# EasyEDA Pro project Adorkable_EXP.eprj, board PCB1
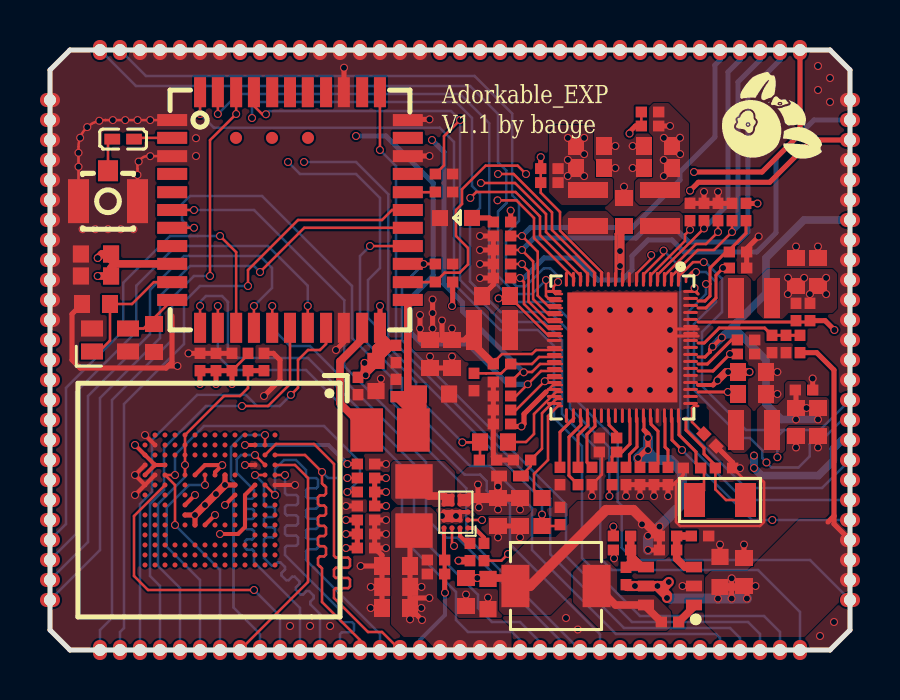
[diagram p3: board, top side]
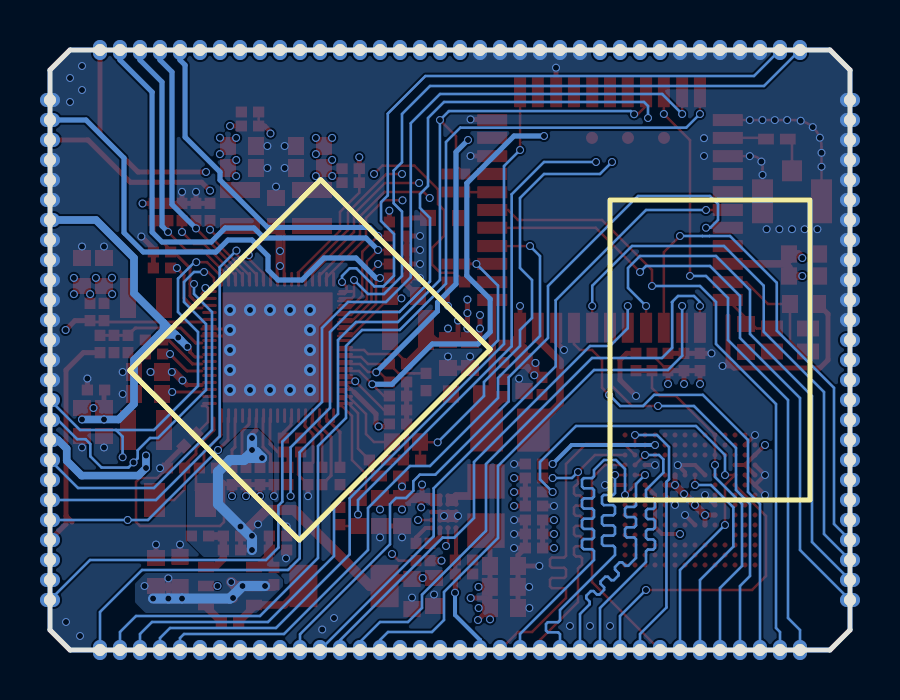
[diagram p4: board, bottom side, seen from below]

Outline 40 x 30 mm; copper layers: Top Layer, GND, PWR, Bottom Layer. Coordinates in mm from the lower left corner of the outline.
Outline path: 0,29 1,30 39,30 40,29 40,1 39,0 1,0 0,1 0,29
Stack: Top Layer 0.035mm 外层铜厚1oz / Dielectric1 0.0994mm 3313 RC57% 4.2mil / GND 0.0152mm 内层铜厚 / Dielectric2 1.265mm 1.3mm H/HOZ Copper / PWR 0.0152mm 内层铜厚 / Dielectric3 0.0994mm 3313 RC57% 4.2mil / Bottom Layer 0.035mm 外层铜厚1oz

## Design rules (mm)
net EMMC_RSTN: EMMC
net EMMC_D0/FLASH_D0: EMMC
net EMMC_CMD: EMMC
net EMMC_D1/FLASH_D1: EMMC
net EMMC_D2/FLASH_D2: EMMC
net EMMC_D3/FLASH_D3: EMMC
net EMMC_D4/FLASH_D4: EMMC
net EMMC_D5/FLASH_D5: EMMC
net EMMC_D6/FLASH_D6: EMMC
net EMMC_D7/FLASH_D7: EMMC
net EMMC_DATA_STROBE: EMMC
net EMMC_CLKOUT/FLASH_DQS: EMMC
template: 自定义配置
spacing copperThickness1oz (default): track to track 0.102, other pairs 0 to 0.3
spacing copperThickness2oz: track to track 0.203, other pairs 0.152 to 0.3
track width copperThickness1oz (default): min 0.127, default 0.127, max 2.54
track width copperThickness2oz: min 0.127, default 0.127, max 2.54
differential pair differentialPair (default): width min 0.127, default 0.254, max 2.54; gap min 0.152, default 0.152
via viaSize (default): diameter min 0.399, default 0.399, max 1.001; hole min 0.3, default 0.3, max 1.001
net GND uses VCC
net VCC5V0_SYS uses VCC
net VDD_LOGIC uses VCC
net VDD_NPU uses VCC
net VDD_GPU uses VCC
net VDD_CPU uses VCC
pour e1499 uses VCC

## Placement (name value [footprint] x y rotation side)
C98  100nF  [R0402]  31 1.4 0 top
C99  10uF  [C0603]  34.7 3.9 270 top
C100  100nF  [R0603]  33.5 3.9 270 top
C101  22pF  [R0402]  30.9 5 180 top
C102  100nF  [R0603]  21.9 2.8 90 top
C103  100nF  [R0402]  28.6 5 0 top
C104  22uF  [C0603]  20.8 2.9 90 top
C105  22uF  [C0603]  28.7 21.9 270 top
C106  10uF  [R0402]  34.4 19.1 0 top
C107  1uF  [R0402]  22.6 19.3 0 top
C108  1uF  [R0402]  22.6 18.6 180 top
C109  1uF  [R0402]  22.6 20 180 top
C110  1uF  [R0402]  22.6 20.7 180 top
C111  1uF  [R0402]  24.97 23.37 0 top
C112  22uF  [C0603]  27 24.1 0 top
C113  10uF  [C0603]  27 25.2 180 top
C114  22uF  [C0603]  37.3 18.9 90 top
C115  10uF  [C0603]  38.4 18.9 270 top
C116  1uF  [R0402]  37.3 16.9 90 top
C117  1uF  [R0402]  22.6 12 0 top
C118  1uF  [R0402]  22.6 13.4 180 top
C119  1uF  [R0402]  22.6 12.7 180 top
C120  1uF  [R0402]  22.6 11.3 180 top
C121  1uF  [R0402]  33.4 21.9 270 top
C122  1uF  [R0402]  34.1 21.9 90 top
C123  10uF  [C0603]  22.3 17.7 0 top
C124  1uF  [R0402]  32.7 21.9 90 top
C125  1uF  [R0402]  32 21.9 90 top
C126  1uF  [R0402]  30 26.2 180 top
C127  22uF  [C0603]  30.4 24.1 180 top
C128  10uF  [C0603]  30.4 25.2 0 top
C129  1uF  [R0402]  34.8 14.8 180 top
C130  1uF  [R0402]  34.8 15.5 0 top
C131  22uF  [C0603]  20.1 14.8 270 top
C132  10uF  [C0603]  19 14.8 90 top
C133  10uF  [C0603]  35.1 13.9 0 top
C134  10uF  [C0603]  35.1 12.8 180 top
C135  22uF  [C0603]  38.4 11.4 270 top
C136  10uF  [C0603]  37.3 11.4 90 top
C137  1uF  [R0402]  30.2 8.7 90 top
C138  1uF  [R0402]  29.5 8.7 270 top
C139  10uF  [R0402]  23.6 9.5 0 top
C140  12pF  [R0402]  32.1 9.1 0 top
C141  4.7uF  [R0402]  26.4 8.7 90 top
C142  100pF  [R0402]  27.9 10.6 180 top
C143  12pF  [R0402]  33.7 9.1 0 top
C144  1uF  [R0402]  27.1 8.7 90 top
C145  1uF  [R0402]  25.5 8.7 90 top
C146  1uF  [R0402]  30.9 8.7 90 top
C147  1uF  [R0402]  28.8 8.7 90 top
C148  680pF  [R0402]  21.9 9.5 180 top
C149  680pF  [R0402]  25.5 6.7 270 top
C150  100nF  [R0402]  28.1 8.7 270 top
C151  100nF  [R0402]  36.1 15.3 90 top
C152  27pF  [R0402]  27.9 9.9 0 top
C153  100nF  [R0402]  34.4 19.9 180 top
C154  100nF  [R0402]  33 10.5 315 top
C155  22uF  [C0603]  22.4 6.9 90 top
C156  22uF  [C0603]  23.5 6.9 90 top
C157  1uF  [R0402]  19.3 4.5 0 top
C158  22uF  [C0603]  17.3 2.1 0 top
C159  22uF  [C0603]  17.31 3.16 0 top
C160  22uF  [C0603]  17.3 4.2 0 top
C162  1uF  [R0402]  37.7 13 180 top
C225  100nF  [R0402]  15.8 7.2 180 top
C226  100nF  [R0402]  9.1 14.4 90 top
C227  100nF  [R0402]  8.3 14.4 90 top
C228  100nF  [R0402]  7.5 14.4 90 top
C229  4.7uF  [R0402]  15.4 13.2 90 top
C230  100nF  [R0402]  15.8 5.1 0 top
C231  100nF  [R0402]  15.8 5.8 0 top
C232  4.7uF  [R0402]  15.8 6.5 180 top
C233  2.2uF  [R0402]  15.8 9.3 180 top
C234  100nF  [R0402]  10.7 14.4 270 top
C261  10pF  [C0402]  3.66 25.55 0 top
C262  100nF  [R0603]  2.3 19.8 0 top
C263  1uF  [R0603]  2.3 18.7 0 top
C264  12pF  [C0603]  5.2 15.6 90 top
C265  12pF  [C0603]  2.3 17.3 0 top
C266  1uF  [R0402]  17.3 14.8 90 top
C267  100nF  [R0603]  16.3 13.7 90 top
C268  4.7uF  [R0402]  17.3 13.1 270 top
C269  100nF  [R0603]  19.2 12.8 180 top
L2  3.3uH  [IND-SMD_L4.4-W4.2]  25.3 3.2 0 top
L3  470nH  [IND-SMD_L2.0-W1.6_MHCHL201610A-1R0M-Q8A]  26.9 22.1 270 top
L4  470nH  [IND-SMD_L2.0-W1.6_MHCHL201610A-1R0M-Q8A]  35.2 17.6 0 top
L5  470nH  [IND-SMD_L2.0-W1.6_MHCHL201610A-1R0M-Q8A]  30.5 22.1 270 top
L6  470nH  [IND-SMD_L2.0-W1.6_MHCHL201610A-1R0M-Q8A]  22.1 16 180 top
L7  470nH  [IND-SMD_L2.0-W1.6_MHCHL201610A-1R0M-Q8A]  35.2 11 0 top
L8  BLM15AG121SN1D  [L0402]  23 8.7 0 top
L9  BLM18PG181SN1D  [L0603]  24.6 6.9 270 top
L10  BLM18PG181SN1D  [L0603]  22.2 10.4 180 top
L11  240nH  [IND-SMD_L2.5-W2.0_WPN252012H]  18.2 7.2 90 top
L16  4.7uH  [L1008]  17 11 180 top
LED1  19-217/GHC-YR1S2/3T  [LED0603-RD]  20.3 21.6 0 top
NOREF  -  [Pad_e213]  19.5 0 0 top
NOREF#2  -  [Pad_e287]  7.5 30 0 top
NOREF#3  -  [Pad_e260]  35.5 30 0 top
NOREF#4  -  [Pad_e195]  37.5 0 0 top
NOREF#5  -  [Pad_e174]  40 16.5 90 top
NOREF#6  -  [Pad_e258]  37.5 30 0 top
NOREF#7  -  [Pad_e223]  9.5 0 0 top
NOREF#8  -  [Pad_e283]  11.5 30 0 top
NOREF#9  -  [Pad_e180]  40 10.5 90 top
NOREF#10  -  [Pad_e281]  13.5 30 0 top
NOREF#11  -  [Pad_e208]  22.5 0 0 top
NOREF#12  -  [Pad_e160]  40 26.5 90 top
NOREF#13  -  [Pad_e267]  26.5 30 0 top
NOREF#14  -  [Pad_e198]  32.5 0 0 top
NOREF#15  -  [Pad_e205]  27.5 0 0 top
NOREF#16  -  [Pad_e252]  0 4.5 90 top
NOREF#17  -  [Pad_e250]  0 6.5 90 top
NOREF#18  -  [Pad_e230]  0 27.5 90 top
NOREF#19  -  [Pad_e241]  0 17.5 90 top
NOREF#20  -  [Pad_e243]  0 15.5 90 top
NOREF#21  -  [Pad_e183]  40 9.5 90 top
NOREF#22  -  [Pad_e280]  12.5 30 0 top
NOREF#23  -  [Pad_e218]  12.5 0 0 top
NOREF#24  -  [Pad_e220]  10.5 0 0 top
NOREF#25  -  [Pad_e278]  17.5 30 0 top
NOREF#26  -  [Pad_e171]  40 21.5 90 top
NOREF#27  -  [Pad_e207]  25.5 0 0 top
NOREF#28  -  [Pad_e269]  24.5 30 0 top
NOREF#29  -  [Pad_e257]  36.5 30 0 top
NOREF#30  -  [Pad_e244]  0 12.5 90 top
NOREF#31  -  [Pad_e273]  20.5 30 0 top
NOREF#32  -  [Pad_e178]  40 12.5 90 top
NOREF#33  -  [Pad_e233]  0 24.5 90 top
NOREF#34  -  [Pad_e206]  24.5 0 0 top
NOREF#35  -  [Pad_e261]  32.5 30 0 top
NOREF#36  -  [Pad_e279]  15.5 30 0 top
NOREF#37  -  [Pad_e232]  0 22.5 90 top
NOREF#38  -  [Pad_e271]  22.5 30 0 top
NOREF#39  -  [Pad_e177]  40 15.5 90 top
NOREF#40  -  [Pad_e165]  40 24.5 90 top
NOREF#41  -  [Pad_e276]  19.5 30 0 top
NOREF#42  -  [Pad_e225]  7.5 0 0 top
NOREF#43  -  [Pad_e222]  8.5 0 0 top
NOREF#44  -  [Pad_e228]  2.5 0 0 top
NOREF#45  -  [Pad_e217]  15.5 0 0 top
NOREF#46  -  [Pad_e291]  3.5 30 0 top
NOREF#47  -  [Pad_e254]  0 2.5 90 top
NOREF#48  -  [Pad_e204]  26.5 0 0 top
NOREF#49  -  [Pad_e182]  40 8.5 90 top
NOREF#50  -  [Pad_e253]  0 5.5 90 top
NOREF#51  -  [Pad_e212]  18.5 0 0 top
NOREF#52  -  [Pad_e240]  0 16.5 90 top
NOREF#53  -  [Pad_e231]  0 26.5 90 top
NOREF#54  -  [Pad_e236]  0 20.5 90 top
NOREF#55  -  [Pad_e189]  40 3.5 90 top
NOREF#56  -  [Pad_e196]  34.5 0 0 top
NOREF#57  -  [Pad_e249]  0 9.5 90 top
NOREF#58  -  [Pad_e265]  28.5 30 0 top
NOREF#59  -  [Pad_e210]  20.5 0 0 top
NOREF#60  -  [Pad_e229]  3.5 0 0 top
NOREF#61  -  [Pad_e221]  11.5 0 0 top
NOREF#62  -  [Pad_e285]  9.5 30 0 top
NOREF#63  -  [Pad_e167]  40 22.5 90 top
NOREF#64  -  [Pad_e288]  4.5 30 0 top
NOREF#65  -  [Pad_e284]  8.5 30 0 top
NOREF#66  -  [Pad_e286]  6.5 30 0 top
NOREF#67  -  [Pad_e203]  29.5 0 0 top
NOREF#68  -  [Pad_e201]  31.5 0 0 top
NOREF#69  -  [Pad_e270]  25.5 30 0 top
NOREF#70  -  [Pad_e251]  0 7.5 90 top
NOREF#71  -  [Pad_e275]  18.5 30 0 top
NOREF#72  -  [Pad_e185]  40 7.5 90 top
NOREF#73  -  [Pad_e282]  10.5 30 0 top
NOREF#74  -  [Pad_e202]  28.5 0 0 top
NOREF#75  -  [Pad_e209]  23.5 0 0 top
NOREF#76  -  [Pad_e199]  33.5 0 0 top
NOREF#77  -  [Pad_e246]  0 10.5 90 top
NOREF#78  -  [Pad_e214]  16.5 0 0 top
NOREF#79  -  [Pad_e247]  0 11.5 90 top
NOREF#80  -  [Pad_e227]  5.5 0 0 top
NOREF#81  -  [Pad_e173]  40 19.5 90 top
NOREF#82  -  [Pad_e262]  33.5 30 0 top
NOREF#83  -  [Pad_e216]  14.5 0 0 top
NOREF#84  -  [Pad_e168]  40 23.5 90 top
NOREF#85  -  [Pad_e186]  40 4.5 90 top
NOREF#86  -  [Pad_e211]  21.5 0 0 top
NOREF#87  -  [Pad_e259]  34.5 30 0 top
NOREF#88  -  [Pad_e184]  40 6.5 90 top
NOREF#89  -  [Pad_e234]  0 25.5 90 top
NOREF#90  -  [Pad_e226]  4.5 0 0 top
NOREF#91  -  [Pad_e170]  40 20.5 90 top
NOREF#92  -  [Pad_e194]  36.5 0 0 top
NOREF#93  -  [Pad_e266]  29.5 30 0 top
NOREF#94  -  [Pad_e264]  31.5 30 0 top
NOREF#95  -  [Pad_e166]  40 25.5 90 top
NOREF#96  -  [Pad_e255]  0 3.5 90 top
NOREF#97  -  [Pad_e239]  0 19.5 90 top
NOREF#98  -  [Pad_e175]  40 17.5 90 top
NOREF#99  -  [Pad_e181]  40 11.5 90 top
NOREF#100  -  [Pad_e268]  27.5 30 0 top
NOREF#101  -  [Pad_e238]  0 18.5 90 top
NOREF#102  -  [Pad_e256]  14.5 30 0 top
NOREF#103  -  [Pad_e272]  23.5 30 0 top
NOREF#104  -  [Pad_e263]  30.5 30 0 top
NOREF#105  -  [Pad_e187]  40 5.5 90 top
NOREF#106  -  [Pad_e274]  21.5 30 0 top
NOREF#107  -  [Pad_e242]  0 14.5 90 top
NOREF#108  -  [Pad_e235]  0 23.5 90 top
NOREF#109  -  [Pad_e245]  0 13.5 90 top
NOREF#110  -  [Pad_e188]  40 2.5 90 top
NOREF#111  -  [Pad_e237]  0 21.5 90 top
NOREF#112  -  [Pad_e172]  40 18.5 90 top
NOREF#113  -  [Pad_e179]  40 13.5 90 top
NOREF#114  -  [Pad_e197]  35.5 0 0 top
NOREF#115  -  [Pad_e290]  2.5 30 0 top
NOREF#116  -  [Pad_e277]  16.5 30 0 top
NOREF#117  -  [Pad_e176]  40 14.5 90 top
NOREF#118  -  [Pad_e224]  6.5 0 0 top
NOREF#119  -  [Pad_e289]  5.5 30 0 top
NOREF#120  -  [Pad_e200]  30.5 0 0 top
NOREF#121  -  [Pad_e248]  0 8.5 90 top
NOREF#122  -  [Pad_e219]  13.5 0 0 top
NOREF#123  -  [Pad_e215]  17.5 0 0 top
NOREF#124  -  [Pad_e158]  40 27.5 90 top
R36  47kΩ  [R0402]  28.8 3.7 270 top
R37  232kΩ  [R0402]  30.9 5.7 180 top
R39  4.7kΩ  [R0402]  22.6 21.4 0 top
R40  51kΩ  [R0402]  32.5 5.7 180 top
R41  0402WGF1000TCE  [R0402]  24.97 24.07 0 top
R42  0402WGF1000TCE  [R0402]  38 16.9 90 top
R43  0402WGF1000TCE  [R0402]  30 26.9 180 top
R44  47kΩ  [R0402]  22.6 14.3 0 top
R45  120kΩ  [R0402]  21.2 13.4 90 top
R48  180kΩ  [R0402]  37.5 15.3 270 top
R49  10kΩ  [R0402]  19.7 18.4 180 top
R51  56kΩ  [R0402]  36.8 15.3 90 top
R52  10kΩ  [R0402]  34.8 21.9 270 top
R53  0402WGF5102TCE  [R0402]  21 4.9 270 top
R54  0402WGF1000TCE  [R0402]  19.3 3.8 0 top
R57  22Ω  [R0402]  21.7 4.9 90 top
R84  10kΩ  [R0402]  15.8 8.6 180 top
R85  10kΩ  [R0402]  15.8 7.9 0 top
R86  10kΩ  [R0402]  9.9 14.4 90 top
R106  10kΩ  [R0402]  19.7 23.8 180 top
R107  0Ω  [R0402]  19.7 22.9 0 top
R108  4.7kΩ  [R0402]  19.7 19.3 0 top
R122  30kΩ  [R0402]  28.6 5.7 0 top
RF1  BWIPX-1-001E  [IPEX-SMD_BWIPX-1-001E]  2.9 23.2 270 top
U2  SY8113BADC  [TSOT-23-6_L2.9-W1.6-P0.95-LS2.8-BR]  31 3.2 0 top
U3  -  [TCS4525]  20.9 6.1 180 top
U6  SDINBDG4-8G  [FBGA-153_L13.0-W11.5-P0.50_KLMAG1JETD-B041]  8 7.5 270 top
U15  2.4GHz  [QFN-44_L12.0-W12.0-P0.90-TL_AP6212]  12 22 0 top
U21  -  [RK809-5]  29 15 270 top
X2  32.768kHz  [CRYSTAL-SMD_L3.2-W1.5-1]  33.5 7.5 180 top
X3  26MHz  [CRYSTAL-SMD_4P-L2.0-W1.6-BL]  3 15.5 0 top

## Footprints (pads in the part's own frame, mm; a bottom-side part is the same pattern mirrored in y, then rotated)
C0402
  rect 0.79x0.54 smd: 1(-0.545,0) 2(0.545,0)
C0603
  rect 0.8x0.9 smd: 1(-0.7,0) 2(0.7,0)
CRYSTAL-SMD_4P-L2.0-W1.6-BL
  rect 1.1x0.8 smd: 1(-0.9,-0.575) 2(0.9,-0.575) 3(0.9,0.575) 4(-0.9,0.575)
CRYSTAL-SMD_L3.2-W1.5-1
  rect 1.05x1.7 smd: 1(-1.275,0) 2(1.275,0)
FBGA-153_L13.0-W11.5-P0.50_KLMAG1JETD-B041
  round 0.25 smd: A1(-3.25,3.25) A3(-2.25,3.25) A4(-1.75,3.25) A5(-1.25,3.25) A6(-0.75,3.25) A8(0.25,3.25) A9(0.75,3.25) A10(1.25,3.25) A11(1.75,3.25) A12(2.25,3.25) A13(2.75,3.25) A14(3.25,3.25) B2(-2.75,2.75) B3(-2.25,2.75) B4(-1.75,2.75) B5(-1.25,2.75) B6(-0.75,2.75) B7(-0.25,2.75) B8(0.25,2.75) B9(0.75,2.75) B10(1.25,2.75) B11(1.75,2.75) B12(2.25,2.75) B13(2.75,2.75) B14(3.25,2.75) C1(-3.25,2.25) C2(-2.75,2.25) C4(-1.75,2.25) C6(-0.75,2.25) C7(-0.25,2.25) C8(0.25,2.25) C9(0.75,2.25) C10(1.25,2.25) C11(1.75,2.25) C12(2.25,2.25) C13(2.75,2.25) C14(3.25,2.25) D1(-3.25,1.75) D3(-2.25,1.75) D4(-1.75,1.75) D12(2.25,1.75) D13(2.75,1.75) D14(3.25,1.75) E1(-3.25,1.25) E2(-2.75,1.25) E3(-2.25,1.25) E5(-1.25,1.25) E6(-0.75,1.25) E7(-0.25,1.25) E8(0.25,1.25) E9(0.75,1.25) E10(1.25,1.25) E12(2.25,1.25) E13(2.75,1.25) E14(3.25,1.25) F1(-3.25,0.75) F2(-2.75,0.75) F3(-2.25,0.75) F5(-1.25,0.75) F10(1.25,0.75) F12(2.25,0.75) F13(2.75,0.75) F14(3.25,0.75) G1(-3.25,0.25) G2(-2.75,0.25) G3(-2.25,0.25) G5(-1.25,0.25) G10(1.25,0.25) G12(2.25,0.25) G13(2.75,0.25) G14(3.25,0.25) H1(-3.25,-0.25) H2(-2.75,-0.25) H3(-2.25,-0.25) H5(-1.25,-0.25) H10(1.25,-0.25) H12(2.25,-0.25) H13(2.75,-0.25) H14(3.25,-0.25) J1(-3.25,-0.75) J2(-2.75,-0.75) J3(-2.25,-0.75) J5(-1.25,-0.75) J10(1.25,-0.75) J12(2.25,-0.75) J13(2.75,-0.75) J14(3.25,-0.75) K1(-3.25,-1.25) K2(-2.75,-1.25) K3(-2.25,-1.25) K5(-1.25,-1.25) K6(-0.75,-1.25) K7(-0.25,-1.25) K8(0.25,-1.25) K9(0.75,-1.25) K10(1.25,-1.25) K12(2.25,-1.25) K13(2.75,-1.25) K14(3.25,-1.25) L1(-3.25,-1.75) L2(-2.75,-1.75) L3(-2.25,-1.75) L12(2.25,-1.75) L13(2.75,-1.75) L14(3.25,-1.75) M1(-3.25,-2.25) M2(-2.75,-2.25) M3(-2.25,-2.25) M4(-1.75,-2.25) M5(-1.25,-2.25) M6(-0.75,-2.25) M7(-0.25,-2.25) M8(0.25,-2.25) M9(0.75,-2.25) M10(1.25,-2.25) M11(1.75,-2.25) M12(2.25,-2.25) M13(2.75,-2.25) M14(3.25,-2.25) N1(-3.25,-2.75) N2(-2.75,-2.75) N3(-2.25,-2.75) N4(-1.75,-2.75) N5(-1.25,-2.75) N6(-0.75,-2.75) N8(0.25,-2.75) N9(0.75,-2.75) N10(1.25,-2.75) N11(1.75,-2.75) N12(2.25,-2.75) N13(2.75,-2.75) N14(3.25,-2.75) P1(-3.25,-3.25) P2(-2.75,-3.25) P3(-2.25,-3.25) P4(-1.75,-3.25) P5(-1.25,-3.25) P6(-0.75,-3.25) P7(-0.25,-3.25) P9(0.75,-3.25) P10(1.25,-3.25) P11(1.75,-3.25) P12(2.25,-3.25) P13(2.75,-3.25) P14(3.25,-3.25)
IND-SMD_L2.0-W1.6_MHCHL201610A-1R0M-Q8A
  rect 0.8x2 smd: 1(-0.9,0) 2(0.9,0)
IND-SMD_L2.5-W2.0_WPN252012H
  rect 1.724x1.87 smd: 1(1.228,0) 2(-1.228,0)
IND-SMD_L4.4-W4.2
  rect 1.4x2.12 smd: 1(2.028,0) 2(-2.028,0)
IPEX-SMD_BWIPX-1-001E
  rect 1.05x1 smd: 1(-0.762,0)
  rect 2.2x1.05 smd: 2(0.762,-1.475) 3(0.762,1.475)
L0402
  rect 0.79x0.54 smd: 1(-0.545,0) 2(0.545,0)
L0603
  rect 0.8x0.864 smd: 1(-0.7,0) 2(0.7,0)
L1008
  rect 1.635x2.16 smd: 1(-1.167,0) 2(1.167,0)
LED0603-RD
  rect 0.8x0.8 smd: 1(-0.799,-0.004) 2(0.799,0.004)
Pad_e158
  oval 0.7x1 hole 0.6: 1(0,0)
Pad_e160
  oval 0.7x1 hole 0.6: 2(0,0)
Pad_e165
  oval 0.7x1 hole 0.6: 4(0,0)
Pad_e166
  oval 0.7x1 hole 0.6: 3(0,0)
Pad_e167
  oval 0.7x1 hole 0.6: 6(0,0)
Pad_e168
  oval 0.7x1 hole 0.6: 5(0,0)
Pad_e170
  oval 0.7x1 hole 0.6: 8(0,0)
Pad_e171
  oval 0.7x1 hole 0.6: 7(0,0)
Pad_e172
  oval 0.7x1 hole 0.6: 10(0,0)
Pad_e173
  oval 0.7x1 hole 0.6: 9(0,0)
Pad_e174
  oval 0.7x1 hole 0.6: 12(0,0)
Pad_e175
  oval 0.7x1 hole 0.6: 11(0,0)
Pad_e176
  oval 0.7x1 hole 0.6: 14(0,0)
Pad_e177
  oval 0.7x1 hole 0.6: 13(0,0)
Pad_e178
  oval 0.7x1 hole 0.6: 16(0,0)
Pad_e179
  oval 0.7x1 hole 0.6: 15(0,0)
Pad_e180
  oval 0.7x1 hole 0.6: 18(0,0)
Pad_e181
  oval 0.7x1 hole 0.6: 17(0,0)
Pad_e182
  oval 0.7x1 hole 0.6: 20(0,0)
Pad_e183
  oval 0.7x1 hole 0.6: 19(0,0)
Pad_e184
  oval 0.7x1 hole 0.6: 22(0,0)
Pad_e185
  oval 0.7x1 hole 0.6: 21(0,0)
Pad_e186
  oval 0.7x1 hole 0.6: 24(0,0)
Pad_e187
  oval 0.7x1 hole 0.6: 23(0,0)
Pad_e188
  oval 0.7x1 hole 0.6: 26(0,0)
Pad_e189
  oval 0.7x1 hole 0.6: 25(0,0)
Pad_e194
  oval 0.7x1 hole 0.6: 28(0,0)
Pad_e195
  oval 0.7x1 hole 0.6: 27(0,0)
Pad_e196
  oval 0.7x1 hole 0.6: 30(0,0)
Pad_e197
  oval 0.7x1 hole 0.6: 29(0,0)
Pad_e198
  oval 0.7x1 hole 0.6: 32(0,0)
Pad_e199
  oval 0.7x1 hole 0.6: 31(0,0)
Pad_e200
  oval 0.7x1 hole 0.6: 34(0,0)
Pad_e201
  oval 0.7x1 hole 0.6: 33(0,0)
Pad_e202
  oval 0.7x1 hole 0.6: 36(0,0)
Pad_e203
  oval 0.7x1 hole 0.6: 35(0,0)
Pad_e204
  oval 0.7x1 hole 0.6: 38(0,0)
Pad_e205
  oval 0.7x1 hole 0.6: 37(0,0)
Pad_e206
  oval 0.7x1 hole 0.6: 40(0,0)
Pad_e207
  oval 0.7x1 hole 0.6: 39(0,0)
Pad_e208
  oval 0.7x1 hole 0.6: 42(0,0)
Pad_e209
  oval 0.7x1 hole 0.6: 41(0,0)
Pad_e210
  oval 0.7x1 hole 0.6: 44(0,0)
Pad_e211
  oval 0.7x1 hole 0.6: 43(0,0)
Pad_e212
  oval 0.7x1 hole 0.6: 46(0,0)
Pad_e213
  oval 0.7x1 hole 0.6: 45(0,0)
Pad_e214
  oval 0.7x1 hole 0.6: 48(0,0)
Pad_e215
  oval 0.7x1 hole 0.6: 47(0,0)
Pad_e216
  oval 0.7x1 hole 0.6: 50(0,0)
Pad_e217
  oval 0.7x1 hole 0.6: 49(0,0)
Pad_e218
  oval 0.7x1 hole 0.6: 52(0,0)
Pad_e219
  oval 0.7x1 hole 0.6: 51(0,0)
Pad_e220
  oval 0.7x1 hole 0.6: 54(0,0)
Pad_e221
  oval 0.7x1 hole 0.6: 53(0,0)
Pad_e222
  oval 0.7x1 hole 0.6: 56(0,0)
Pad_e223
  oval 0.7x1 hole 0.6: 55(0,0)
Pad_e224
  oval 0.7x1 hole 0.6: 58(0,0)
Pad_e225
  oval 0.7x1 hole 0.6: 57(0,0)
Pad_e226
  oval 0.7x1 hole 0.6: 60(0,0)
Pad_e227
  oval 0.7x1 hole 0.6: 59(0,0)
Pad_e228
  oval 0.7x1 hole 0.6: 62(0,0)
Pad_e229
  oval 0.7x1 hole 0.6: 61(0,0)
Pad_e230
  oval 0.7x1 hole 0.6: 88(0,0)
Pad_e231
  oval 0.7x1 hole 0.6: 87(0,0)
Pad_e232
  oval 0.7x1 hole 0.6: 83(0,0)
Pad_e233
  oval 0.7x1 hole 0.6: 85(0,0)
Pad_e234
  oval 0.7x1 hole 0.6: 86(0,0)
Pad_e235
  oval 0.7x1 hole 0.6: 84(0,0)
Pad_e236
  oval 0.7x1 hole 0.6: 81(0,0)
Pad_e237
  oval 0.7x1 hole 0.6: 82(0,0)
Pad_e238
  oval 0.7x1 hole 0.6: 79(0,0)
Pad_e239
  oval 0.7x1 hole 0.6: 80(0,0)
Pad_e240
  oval 0.7x1 hole 0.6: 77(0,0)
Pad_e241
  oval 0.7x1 hole 0.6: 78(0,0)
Pad_e242
  oval 0.7x1 hole 0.6: 75(0,0)
Pad_e243
  oval 0.7x1 hole 0.6: 76(0,0)
Pad_e244
  oval 0.7x1 hole 0.6: 73(0,0)
Pad_e245
  oval 0.7x1 hole 0.6: 74(0,0)
Pad_e246
  oval 0.7x1 hole 0.6: 71(0,0)
Pad_e247
  oval 0.7x1 hole 0.6: 72(0,0)
Pad_e248
  oval 0.7x1 hole 0.6: 69(0,0)
Pad_e249
  oval 0.7x1 hole 0.6: 70(0,0)
Pad_e250
  oval 0.7x1 hole 0.6: 67(0,0)
Pad_e251
  oval 0.7x1 hole 0.6: 68(0,0)
Pad_e252
  oval 0.7x1 hole 0.6: 65(0,0)
Pad_e253
  oval 0.7x1 hole 0.6: 66(0,0)
Pad_e254
  oval 0.7x1 hole 0.6: 63(0,0)
Pad_e255
  oval 0.7x1 hole 0.6: 64(0,0)
Pad_e256
  oval 0.7x1 hole 0.6: 101(0,0)
Pad_e257
  oval 0.7x1 hole 0.6: 123(0,0)
Pad_e258
  oval 0.7x1 hole 0.6: 124(0,0)
Pad_e259
  oval 0.7x1 hole 0.6: 121(0,0)
Pad_e260
  oval 0.7x1 hole 0.6: 122(0,0)
Pad_e261
  oval 0.7x1 hole 0.6: 119(0,0)
Pad_e262
  oval 0.7x1 hole 0.6: 120(0,0)
Pad_e263
  oval 0.7x1 hole 0.6: 117(0,0)
Pad_e264
  oval 0.7x1 hole 0.6: 118(0,0)
Pad_e265
  oval 0.7x1 hole 0.6: 115(0,0)
Pad_e266
  oval 0.7x1 hole 0.6: 116(0,0)
Pad_e267
  oval 0.7x1 hole 0.6: 113(0,0)
Pad_e268
  oval 0.7x1 hole 0.6: 114(0,0)
Pad_e269
  oval 0.7x1 hole 0.6: 111(0,0)
Pad_e270
  oval 0.7x1 hole 0.6: 112(0,0)
Pad_e271
  oval 0.7x1 hole 0.6: 109(0,0)
Pad_e272
  oval 0.7x1 hole 0.6: 110(0,0)
Pad_e273
  oval 0.7x1 hole 0.6: 107(0,0)
Pad_e274
  oval 0.7x1 hole 0.6: 108(0,0)
Pad_e275
  oval 0.7x1 hole 0.6: 105(0,0)
Pad_e276
  oval 0.7x1 hole 0.6: 106(0,0)
Pad_e277
  oval 0.7x1 hole 0.6: 103(0,0)
Pad_e278
  oval 0.7x1 hole 0.6: 104(0,0)
Pad_e279
  oval 0.7x1 hole 0.6: 102(0,0)
Pad_e280
  oval 0.7x1 hole 0.6: 99(0,0)
Pad_e281
  oval 0.7x1 hole 0.6: 100(0,0)
Pad_e282
  oval 0.7x1 hole 0.6: 97(0,0)
Pad_e283
  oval 0.7x1 hole 0.6: 98(0,0)
Pad_e284
  oval 0.7x1 hole 0.6: 95(0,0)
Pad_e285
  oval 0.7x1 hole 0.6: 96(0,0)
Pad_e286
  oval 0.7x1 hole 0.6: 93(0,0)
Pad_e287
  oval 0.7x1 hole 0.6: 94(0,0)
Pad_e288
  oval 0.7x1 hole 0.6: 91(0,0)
Pad_e289
  oval 0.7x1 hole 0.6: 92(0,0)
Pad_e290
  oval 0.7x1 hole 0.6: 89(0,0)
Pad_e291
  oval 0.7x1 hole 0.6: 90(0,0)
QFN-44_L12.0-W12.0-P0.90-TL_AP6212
  rect 1.5x0.6 smd: 1(-5.889,4.496) 2(-5.889,3.607) 3(-5.889,2.692) 4(-5.889,1.804) 5(-5.889,0.889) 6(-5.889,0) 7(-5.889,-0.889) 8(-5.889,-1.804) 9(-5.889,-2.692) 10(-5.889,-3.607) 11(-5.889,-4.496) 23(5.889,-4.496) 24(5.889,-3.607) 25(5.889,-2.692) 26(5.889,-1.804) 27(5.889,-0.889) 28(5.889,0) 29(5.889,0.889) 30(5.889,1.804) 31(5.889,2.692) 32(5.889,3.607) 33(5.889,4.496)
  rect 0.6x1.5 smd: 12(-4.496,-5.889) 13(-3.607,-5.889) 14(-2.692,-5.889) 15(-1.804,-5.889) 16(-0.889,-5.889) 17(0,-5.889) 18(0.889,-5.889) 19(1.804,-5.889) 20(2.692,-5.889) 21(3.607,-5.889) 22(4.496,-5.889) 34(4.496,5.889) 35(3.607,5.889) 36(2.692,5.889) 37(1.804,5.889) 38(0.889,5.889) 39(0,5.889) 40(-0.889,5.889) 41(-1.804,5.889) 42(-2.692,5.889) 43(-3.607,5.889) 44(-4.496,5.889)
  round 0.6 smd: 45(-2.7,3.607) 46(-0.9,3.607) 47(0.9,3.607)
R0402
  rect 0.566x0.54 smd: 1(-0.433,0) 2(0.433,0)
R0603
  rect 0.806x0.864 smd: 1(-0.753,0) 2(0.753,0)
RK809-5
  oval 0.74x0.15 smd: 1(-3.534,2.419) 2(-3.534,2.069) 3(-3.534,1.719) 4(-3.534,1.369) 5(-3.534,1.019) 6(-3.534,0.669) 7(-3.534,0.319) 8(-3.534,-0.031) 9(-3.534,-0.381) 10(-3.534,-0.731) 11(-3.534,-1.081) 12(-3.534,-1.431) 13(-3.534,-1.781) 14(-3.534,-2.131) 15(-3.534,-2.481) 16(-3.534,-2.831) 17(-3.534,-3.181) 35(3.28,-3.181) 36(3.28,-2.831) 37(3.28,-2.481) 38(3.28,-2.131) 39(3.28,-1.781) 40(3.28,-1.431) 41(3.28,-1.081) 42(3.28,-0.731) 43(3.28,-0.381) 44(3.28,-0.031) 45(3.28,0.319) 46(3.28,0.669) 47(3.28,1.019) 48(3.28,1.369) 49(3.28,1.719) 50(3.28,2.069) 51(3.28,2.419)
  oval 0.15x0.74 smd: 18(-2.927,-3.788) 19(-2.577,-3.788) 20(-2.227,-3.788) 21(-1.877,-3.788) 22(-1.527,-3.788) 23(-1.177,-3.788) 24(-0.827,-3.788) 25(-0.477,-3.788) 26(-0.127,-3.788) 27(0.223,-3.788) 28(0.573,-3.788) 29(0.923,-3.788) 30(1.273,-3.788) 31(1.623,-3.788) 32(1.973,-3.788) 33(2.323,-3.788) 34(2.673,-3.788) 52(2.673,3.026) 53(2.323,3.026) 54(1.973,3.026) 55(1.623,3.026) 56(1.273,3.026) 57(0.923,3.026) 58(0.573,3.026) 59(0.223,3.026) 60(-0.127,3.026) 61(-0.477,3.026) 62(-0.827,3.026) 63(-1.177,3.026) 64(-1.527,3.026) 65(-1.877,3.026) 66(-2.227,3.026) 67(-2.577,3.026) 68(-2.927,3.026)
  rect 5.5x5.5 smd: 69(-0.127,-0.381)
TCS4525
  round 0.265 smd: A1(0,0) A2(0.4,0) A3(0.8,0) A4(1.2,0) B1(0,-0.4) B2(0.4,-0.4) B3(0.8,-0.4) B4(1.2,-0.4) C1(0,-0.8) C2(0.4,-0.8) C3(0.8,-0.8) C4(1.2,-0.8) D1(0,-1.2) D2(0.4,-1.2) D3(0.8,-1.2) D4(1.2,-1.2) E1(0,-1.6) E2(0.4,-1.6) E3(0.8,-1.6) E4(1.2,-1.6)
TSOT-23-6_L2.9-W1.6-P0.95-LS2.8-BR
  rect 0.8x0.532 smd: 1(1.2,-0.95) 2(1.2,0) 3(1.2,0.95) 4(-1.2,0.95) 5(-1.2,0) 6(-1.2,-0.95)

## Nets
GND: C99.1 C100.1 C102.1 C103.1 C104.1 C105.1 C106.2 C107.1 C108.2 C109.2 C110.2 C112.2 C113.1 C114.2 C115.1 C117.1 C118.2 C119.2 C120.2 C121.1 C122.2 C123.1 C124.2 C125.2 C127.2 C128.1 C129.1 C130.2 C131.2 C132.1 C133.2 C134.1 C135.2 C136.1 C137.1 C138.2 C139.1 C140.1 C142.2 C143.2 C144.1 C145.1 C146.1 C147.1 C148.1 C149.1 C151.1 C152.1 C153.1 C154.2 C155.1 C156.1 C158.1 C159.1 C160.1 C162.1 C225.2 C226.2 C227.2 C228.2 C229.1 C230.2 C231.2 C232.1 C233.1 C234.1 C262.1 C263.1 C264.1 C265.1 C266.1 C267.1 C268.1 C269.1 LED1.1 NOREF#2.94 NOREF#5.12 NOREF#10.100 NOREF#18.88 NOREF#19.78 NOREF#25.104 NOREF#33.85 NOREF#36.102 NOREF#37.83 NOREF#39.13 NOREF#40.4 NOREF#52.77 NOREF#53.87 NOREF#54.81 NOREF#63.6 NOREF#64.91 NOREF#65.95 NOREF#66.93 NOREF#71.105 NOREF#81.9 NOREF#84.5 NOREF#89.86 NOREF#91.8 NOREF#97.80 NOREF#98.11 NOREF#101.79 NOREF#102.101 NOREF#108.84 NOREF#111.82 NOREF#112.10 NOREF#113.15 NOREF#116.103 NOREF#117.14 NOREF#119.92 NOREF#124.1 R40.1 R45.1 R51.1 R106.1 R107.2 R108.2 R122.1 RF1.2 RF1.3 U2.2 U3.B2 U3.B3 U3.B4 U3.C1 U3.C2 U3.C3 U3.C4 U6.A6 U6.C4 U6.D4 U6.E7 U6.G5 U6.H10 U6.J5 U6.K8 U6.N2 U6.N5 U6.P1 U6.P4 U6.P6 U15.1 U15.3 U15.20 U15.31 U15.33 U15.36 U21.47 U21.56 U21.62 U21.63 U21.69 X3.2 X3.4
VCC3V3_PMU: C120.1 NOREF#9.18 R52.1 R53.2 U21.31
VCC3V3_SD: C130.1 U21.58
VCC3V3_SYS: C101.2 C102.2 C104.2 C105.2 C106.1 C107.2 C117.2 C121.2 C123.2 C129.2 C134.2 C138.1 C262.2 C263.2 L2.2 R37.2 R39.2 U15.9 U21.4 U21.10 U21.11 U21.22 U21.24 U21.30 U21.45 U21.54 U21.57 U21.66
VCC5V0_SYS: C99.2 C100.2 C155.2 C156.2 L8.1 NOREF#55.25 NOREF#85.24 NOREF#105.23 R36.2 R48.2 U2.5 U3.D1 U3.D2 U3.E1 U3.E2
VCC_3V3: C133.1 C230.1 C231.1 C232.2 NOREF#93.116 NOREF#104.117 U6.E6 U6.F5 U6.J10 U6.K9 U21.55
VCC_DDR: C131.1 C132.2 L6.2 NOREF#20.76 NOREF#30.73 NOREF#77.71 NOREF#79.72 NOREF#107.75 NOREF#109.74 R44.1 U21.26
VCCA1V8_IMAGE: C125.1 NOREF#95.3 U21.6
VCCA1V8_PMU: C124.1 NOREF#87.121 U21.5
VCCA_1V8: C122.1 NOREF#3.122 U21.3
VCCIO_ACODEC: C118.1 NOREF#6.124 U21.28
VCCIO_FLASH: C135.1 C136.2 C162.2 C225.1 C226.1 C227.1 C228.1 C229.2 C266.2 C267.2 L7.2 NOREF#26.7 R49.1 R84.1 R85.2 R86.2 U6.C6 U6.M4 U6.N4 U6.P3 U6.P5 U15.22 U21.59
VCCIO_SD: C119.1 NOREF#22.99 U21.29
VDD_CPU: C157.1 C157.2 C158.2 C159.2 C160.2 L11.2 NOREF.45 NOREF#11.42 NOREF#51.46 NOREF#59.44 NOREF#86.43 R54.1 R54.2 U3.A4
VDD_GPU: C126.1 C126.2 C127.1 C128.2 L5.1 NOREF#13.113 NOREF#58.115 NOREF#69.112 NOREF#100.114 R43.1 R43.2 U21.8
VDD_LOGIC: C111.1 C111.2 C112.1 C113.2 L3.1 NOREF#31.107 NOREF#38.109 NOREF#41.106 NOREF#103.110 NOREF#106.108 R41.1 R41.2 U21.13
VDD_NPU: C114.1 C115.2 C116.1 C116.2 L4.2 NOREF#14.32 NOREF#67.35 NOREF#68.33 NOREF#74.36 NOREF#120.34 R42.1 R42.2 U21.64
VDDA0V9_IMAGE: C108.1 NOREF#12.2 U21.23
VDDA0V9_PMU: C110.1 NOREF#82.120 U21.20
VDDA_0V9: C109.1 NOREF#29.123 U21.21
VIN_LDO: C268.2 C269.2 L16.1 U15.23
VIN_LDO_OUT: L16.2 U15.21
$C98_1: C98.1 L2.1 U2.6
$C98_2: C98.2 U2.1
$C101_1: C101.1 R37.1 R40.2 U2.3
$C103_2: C103.2 R36.1 R122.2 U2.4
$C137_2: C137.2 U21.46
$C139_2: C139.2 L8.2 U21.33
$C140_2: C140.2 U21.50 X2.2
$C141_1: C141.1 U21.36
$C141_2: C141.2 U21.37
$C143_1: C143.1 U21.51 X2.1
$C144_2: C144.2 U21.38
$C145_2: C145.2 U21.35
$C146_2: C146.2 U21.48
$C147_2: C147.2 U21.44
$C150_1: C150.1 C152.2 U21.43
$C151_2: C151.2 R48.1 R51.2 U21.61
$C233_2: C233.2 U6.C2
$C261_1: C261.1 RF1.1
$C261_2: C261.2 U15.2
$L3_2: L3.2 U21.12
$L4_1: L4.1 U21.65
$L5_2: L5.2 U21.9
$L6_1: L6.1 U21.25
$L7_1: L7.1 U21.53
$L9_1: L9.1 U21.34
$L10_1: L10.1 U21.32
$L11_1: L11.1 U3.D3 U3.D4 U3.E3 U3.E4
$LED1_2: LED1.2 R39.1
$R44_2: R44.2 R45.2 U21.27
$R53_1: R53.1 U3.A2
$R107_1: R107.1 U15.29
BT_REG_ON_H: NOREF#56.30 U15.34
BT_WAKE_HOST_H: NOREF#15.37 U15.7
EMMC_CLKOUT/FLASH_DQS: NOREF#61.53 U6.M6
EMMC_CMD: NOREF#43.56 R85.1 U6.M5
EMMC_D0/FLASH_D0: NOREF#45.49 R84.2 U6.A3
EMMC_D1/FLASH_D1: NOREF#7.55 U6.A4
EMMC_D2/FLASH_D2: NOREF#83.50 U6.A5
EMMC_D3/FLASH_D3: NOREF#24.54 U6.B2
EMMC_D4/FLASH_D4: NOREF#123.47 U6.B3
EMMC_D5/FLASH_D5: NOREF#23.52 U6.B4
EMMC_D6/FLASH_D6: NOREF#122.51 U6.B5
EMMC_D7/FLASH_D7: NOREF#78.48 U6.B6
EMMC_DATA_STROBE: NOREF#42.57 U6.H5
EMMC_RSTN: C234.2 NOREF#118.58 R86.1 U6.K1 U6.K2 U6.K3 U6.K5
HOST_WAKE_BT_H: NOREF#48.38 U15.6
HP_SNS: C142.1 U21.40
HPL_OUT: U21.39
HPR_OUT: U21.41
I2C0_SCL_PMIC: NOREF#99.17 U3.A3 U21.1
I2C0_SDA_PMIC: NOREF#32.16 U3.B1 U21.2
I2S1_LRCK_TX_M0_PMIC: NOREF#70.68 U21.14
I2S1_MCLK_M0_PMIC: NOREF#57.70 U21.16
I2S1_SCLK_TX_M0_PMIC: NOREF#121.69 U21.15
I2S1_SDI0_M0/PDM: NOREF#46.90 U21.18
I2S1_SDO0_M0_PMIC: NOREF#17.67 U21.17
I2S2_LRCK_TX_M0: NOREF#60.61 U15.28
I2S2_SCLK_TX_M0: NOREF#76.31 U15.26
I2S2_SDI_M0: NOREF#114.29 R108.1 U15.25
I2S2_SDO_M0: NOREF#47.63 U15.27
MIC1P: C150.2 NOREF#62.96
PDM_CLK0_M0_PMIC: NOREF#115.89 U21.19
PMIC_32KOUT_WIFI: R49.2 U15.24 U21.68
PMIC_INT_L: NOREF#72.21 U21.7
PMIC_SLEEP_H: NOREF#88.22 R57.1 U21.49
PWRON_KEY: C154.1 U21.52
RESETN: C153.2 NOREF#21.19 R52.2 U21.67
SARADC_VIN0: NOREF#28.111
SDMMC1_CLK: NOREF#80.59 U15.17
SDMMC1_CMD: NOREF#27.39 U15.16
SDMMC1_D0: NOREF#16.65 U15.18
SDMMC1_D1: NOREF#90.60 U15.19
SDMMC1_D2: NOREF#50.66 U15.14
SDMMC1_D3: NOREF#96.64 U15.15
SPK_OUTN: C149.2 L9.2 NOREF#8.98
SPK_OUTP: C148.2 L10.2 NOREF#73.97
UART1_CTSN_M0: NOREF#4.27 R106.2 U15.41
UART1_RTSN_M0: NOREF#92.28 U15.44
UART1_RX_M0: NOREF#44.62 U15.42
UART1_TX_M0: NOREF#110.26 U15.43
VSEL_EXTDCDC: R57.2 U3.A1
WIFI_REG_ON_H: NOREF#34.40 U15.12
WIFI_WAKE_HOST_H: NOREF#75.41 U15.13
WIFI_XTAL_IN: C265.2 U15.10 X3.1
WIFI_XTAL_OUT: C264.2 U15.11 X3.3

Pads without a net: NOREF#35 119; NOREF#49 20; NOREF#94 118; U6 A1 A8 A9 A10 A11 A12 A13 A14 B7 B8 B9 B10 B11 B12 B13 B14 C1 C7 C8 C9 C10 C11 C12 C13 C14 D1 D3 D12 D13 D14 E1 E2 E3 E5 E8 E9 E10 E12 E13 E14 F1 F2 F3 F10 F12 F13 F14 G1 G2 G3 G10 G12 G13 G14 H1 H2 H3 H12 H13 H14 J1 J2 J3 J12 J13 J14 K6 K7 K10 K12 K13 K14 L1 L2 L3 L12 L13 L14 M1 M2 M3 M7 M8 M9 M10 M11 M12 M13 M14 N1 N3 N6 N8 N9 N10 N11 N12 N13 N14 P2 P7 P9 P10 P11 P12 P13 P14; U15 4 5 8 30 32 35 37 38 39 40 45 46 47; U21 42 60

## Via types
v1: diameter 0.399, hole 0.299, Top Layer to Bottom Layer, 262 vias
v2: diameter 0.6, hole 0.3, Top Layer to Bottom Layer, 16 vias
v3: diameter 0.4, hole 0.3, Top Layer to Bottom Layer, 5 vias

## Routing (per net, layer and track width the routed paths; a pad name or vN(x,y) marks a point on that pad's centre or on a via; arc(x,y) is an arc through that point)
GND: length 113.2
  Top Layer w0.127: 31.3,8.4 31.3,6.4 31.5,6.2 35.5,6.2 35.7,6.4 35.7,8.4 35.5,8.6 34.63,8.6 34.14,9.09 ; 19.9,6.7 U3.C3 v1(20.3,6.7) ; 19.9,6.7 U3.B4 ; 19.9,6.7 U3.B3 v1(20.3,6.7) ; 19.9,6.7 U3.C4 ; RF1.2 v1(1.43,24.16) v1(1.43,24.86) 1.43,25.16 arc(1.45,25.39) v1(1.51,25.61) arc(1.65,25.9) v1(1.86,26.15) arc(2.14,26.34) v1(2.46,26.46) arc(2.61,26.49) 2.76,26.5 v1(3.14,26.5) v1(3.76,26.5) v1(4.38,26.5) v1(5.01,26.5) U15.1 ; v1(20.3,6.7) U3.B2 ; v1(20.3,6.7) U3.C2 ; U15.3 v1(5.01,24.69) arc(4.68,24.65) v1(4.43,24.42) arc(4.38,24.24) 4.38,24.06 v1(4.38,23.75) RF1.3 ; 27.1,8.28 27.59,8.77 27.59,9.77 C152.1
  Top Layer w0.152: 32.41,16.05 30.05,16.05 29.7,15.7 32.41,15.7 ; C146.1 31.17,8.27 31.67,8.77 C140.1
  Top Layer w0.203: U6.P6 v1(4.25,7.75) ; U6.P6 U6.N5 ; U6.P6 v1(4.25,8.75) U6.P4 ; U3.C3 U3.C2 ; U3.C3 U3.B3 ; U3.C3 U3.C4 U3.B4 U3.B3 ; U3.C2 U3.B2 U3.B3 ; U3.C2 U3.C1 ; U6.C4 v1(9.75,9.25) ; U6.N2 v1(4.75,10.75) ; v1(12.25,8.25) U6.A6 ; U6.H10 v1(8.25,6.75) ; U6.J5 7.75,9.25 8.61,9.25 8.25,8.89 U6.G5 ; U6.E7 v1(8.75,7.25) ; U6.K8 v1(7.25,7.75)
  Top Layer w0.254: C154.2 34.13,9.37 C143.2 34.14,9.09 v1(34.5,9.09) ; v1(14.3,15) 14.69,15.39 U15.20 ; v1(23.5,5.63) C156.1 C155.1 v1(22.4,5.63) ; C160.1 v1(15.53,4.2) ; C160.1 16.6,4.73 C230.2 ; C160.1 16.6,3.16 ; 16.6,3.16 C158.1 v1(16.03,2.1) ; 16.6,3.16 v1(16.04,3.16) ; 16.6,3.16 C159.1 ; v1(10.7,12.7) 11.5,13.5 11.5,14.5 11.17,14.83 10.7,14.83 ; C109.2 v1(21.5,20) ; C109.2 C110.2 v1(21.5,20.7) ; C109.2 C107.1 ; 19,14.11 v1(19,14.67) ; C231.2 v1(16.8,5.8) ; C231.2 C232.1 v1(16.8,6.5) ; C231.2 C230.2 ; C131.2 C132.1 ; 16.55,12.9 v1(16.55,13.57) ; C108.2 22.17,18.27 C123.1 ; C108.2 v1(21.5,18.6) ; C108.2 C107.1 ; 33.4,22.34 v1(33.4,22.91) ; 5.8,14.1 5.91,14.2 v1(6.37,14.2) ; 5.8,14.1 6.1,14.4 6.1,16.7 ; 5.8,14.1 5.8,14.1 1.5,14.1 1.1,14.5 1.1,16.8 C265.1 ; 37.3,10.69 v1(37.3,10.13) ; 18.41,24.7 v1(18.97,24.7) ; 27.1,8.26 v1(27.1,7.69) ; C107.1 v1(21.5,19.3) ; 34.7,4.61 v1(34.7,5.27) ; 14.7,28.55 v1(14.7,29.11) ; 28.17,5.71 v1(28.17,6.17) ; v1(28.2,4.58) 28.2,4.97 28.17,4.99 ; 9.1,14.83 7.5,14.83 ; 21.9,2.05 v1(21.9,2.62) ; 38.13,13.01 v1(38.13,13.57) ; C133.2 v1(36.37,13.9) ; 32.19,3.2 v1(31.63,3.2) ; C230.2 v1(16.8,5.1) ; v1(35.43,20.67) 34.83,20.07 C106.2 ; 32.7,22.34 v1(32.7,22.91) ; 7.49,14.83 v1(6.93,14.83) ; C147.1 C138.2 C137.1 C146.1 ; 20.1,14.11 v1(20.1,14.67) ; 38.4,10.69 v1(38.4,10.13) ; C128.1 v1(29.13,25.2) ; 30.2,8.26 v1(30.2,7.69) ; 32,22.33 34.1,22.33 ; C113.1 v1(28.27,25.2) ; C118.2 C119.2 C117.1 C120.2 22.17,9.67 C148.1 C139.1 ; C134.1 v1(36.37,12.8) ; 28.8,8.26 v1(28.8,7.69) ; 38.4,19.61 v1(38.4,20.17) ; C127.2 v1(29.13,24.1) ; C112.2 v1(28.27,24.1) ; C233.1 v1(16.8,9.3) ; 29.5,8.26 v1(29.5,7.69) ; 30.9,8.26 v1(30.9,7.69) ; 37.3,19.61 v1(37.3,20.17) ; 20.8,2.21 v1(20.8,2.77) ; 18.41,26.53 v1(18.97,26.53) ; C225.2 v1(14.8,7.2) ; C105.1 v1(28.7,23.17) ; 33.5,4.71 v1(33.5,5.27)
  vias: v1(1.63,21.04) v1(2.27,21.04) v1(2.9,21.04) v1(3.53,21.04) v1(4.17,21.04) v1(7.3,25.59) v1(7.3,24.7) v1(8.61,9.25) v1(12,1.2) v1(13,1.2) v1(14,1.2) v1(19.6,6.7) v1(25.8,1.6) v1(26.39,1.02) v1(38.4,29.2) v1(38.4,28) v1(38.5,0.7) v1(39,28.6) v1(39,27.4) v1(39.2,1.4) v2(27,17) v2(27,16) v2(27,15) v2(27,14) v2(27,13) v2(28,17) v2(28,13) v2(29,17) v2(29,13) v2(30,17) v2(30,13) v2(31,17) v2(31,16) v2(31,15) v2(31,14) v2(31,13)
VCC3V3_PMU: length 50.6
  Top Layer w0.127: 25.59,13.25 25.15,13.25 24.8,12.9
  Top Layer w0.254: C120.1 23.15,11.18 v1(23.57,11.18) 23.7,11.31 23.7,11.8 24.8,12.9 ; 34.81,22.33 v1(35.37,22.33)
  Top Layer w0.381: 20.99,4.47 v1(20.43,4.47)
  PWR w0.381: 34.65,10.85 35.6,11.8 35.6,18.8 36,19.2 36,21.7 v1(35.37,22.33) ; 34.65,10.85 34.67,10.84 34.67,10.25 ; 34.65,10.85 34.33,10.53 ; 34.33,10.53 34.39,10.53 34.67,10.25 ; 34.33,10.53 34.11,10.31 ; v1(35.2,9.1) v1(35.2,9.72) 34.67,10.25 ; 34.67,10.25 34.16,10.25 34.11,10.31 ; v1(20.43,4.47) 19.89,4.47 18.7,5.65 18.7,7.25 22.63,11.18 v1(23.57,11.18) 26.51,8.24 32.04,8.24 34.11,10.31
  Bottom Layer w0.381: v1(35.2,9.72) v1(35.2,9.1) 35.58,8.72 38.42,8.72 39.16,9.46 39.16,10.06 39.6,10.5 NOREF#9.18
VCC3V3_SD: length 2.5
  Top Layer w0.152: C130.1 34.07,15.5 32.87,14.3 32.41,14.3
VCC3V3_SYS: length 94.4
  Top Layer w0.127: 25.59,16.4 24.95,16.4 23.93,17.42 23.93,18.93 23.57,19.29 ; 25.59,15.7 24.93,15.7 23,17.63 C123.2 ; C117.2 23.3,12 v1(24.74,13.44) 24.9,13.6 25.59,13.6 ; 30.75,18.41 30.75,18.75 32.3,20.3 32.8,20.3 v1(33.4,20.9) C121.2 ; C107.2 v1(23.6,19.3)
  Top Layer w0.152: 28.65,18.41 28.65,21.15 ; C106.1 v1(33.65,19.1) 33.3,18.75 33.3,17.6 32.8,17.1 32.41,17.1 ; 28.3,18.41 28.3,20.8 28.5,21 ; v1(29.4,9.6) 29.49,9.51 29.49,9.15 29.5,9.13 ; 32.41,13.95 33.15,13.95 v1(34,14.8) C129.2 ; C134.2 34.3,12.9 v1(33.89,12.9) 32.41,12.9 ; 29.7,11 29.7,11.59
  Top Layer w0.254: v1(29.9,5) C101.2 R37.2 ; R39.2 v1(23.03,21.97) ; v1(30.47,6.17) 30.47,5.71 ; C105.2 28.5,21 v1(28.5,19.95) v1(28.5,19.2) ; 29.7,11 29.9,10.8 v1(29.9,10.6) 29.9,10.1 v1(29.4,9.6) ; C123.2 22.88,17.58 v1(22.43,17.58) ; 30.47,5.71 v1(29.9,5.71)
  Top Layer w0.381: 3.25,19.31 3.05,19.11 C263.2 v1(2.39,18.7) ; 3.25,19.31 3.05,19.5 3.05,19.75 3,19.8 2.59,19.8 v1(2.39,19.6) ; 3.25,19.31 U15.9 ; L2.2 22.87,3.6 v1(21.37,3.6) C104.2
  Top Layer w0.508: R37.2 29.17,7 27.8,7 24,3.2 L2.2
  PWR w0.381: 23.03,19.2 v1(23.03,21.97) 23.03,24.12 22.65,24.5 21.4,24.5 19.8,22.9 9.93,22.9 6.91,19.88 2.67,19.88 v1(2.39,19.6) v1(2.39,18.7) ; 23.03,19.2 23.13,19.3 v1(23.6,19.3) ; 23.03,19.2 22.43,18.6 v1(22.43,17.58)
  Bottom Layer w0.508: v1(29.9,10.6) 29.9,9.9 ; 29.9,9.9 30.2,9.6 ; 29.9,9.9 29.7,9.9 v1(29.4,9.6) 30.2,9.6 ; 30.2,9.6 30.3,9.5 31,9.5 31.6,8.9 31.6,7.3 v1(30.47,6.17) 29.9,5.6 v1(29.9,5)
  vias: v1(29.6,6.28) v1(29.9,10)
VCC5V0_SYS: length 48.7
  Top Layer w0.127: U3.E2 20.7,7.5 ; 20.7,7.5 U3.D1 ; 20.7,7.5 U3.D2
  Top Layer w0.203: U3.D1 U3.D2 U3.E2 U3.E1 U3.D1
  Top Layer w0.254: v1(21.44,7.13) 21.44,7.59 21.45,7.59 ; 34.71,3.2 v1(35.27,3.2) ; 39.2,6.7 39.2,6.3 NOREF#105.23 ; 39.2,6.7 39.2,14 38.33,14.87 37.5,14.87 ; 39.2,6.7 38.9,6.4 ; 34.85,3.14 v1(34.85,2.57) ; 22.4,7.59 v1(22.4,7.03) ; v1(34.08,2.57) 34.08,3.14 ; 21.4,7.71 v1(21.4,8.27) ; 34.08,3.15 v1(34.08,3.58) ; 33.4,3.14 v1(33.4,2.57) ; 23.5,7.59 v1(23.5,7.03)
  Top Layer w0.381: 34.6,3.2 34.55,3.15 33.4,3.15 ; L8.1 22.4,8.64 v1(22.4,8.17) C155.2 C156.2
  Top Layer w0.508: 29.35,3.2 29.9,3.2 ; v1(29.25,3.2) 28.87,3.2 R36.2 ; 20.7,7.5 20.9,7.5 21,7.6 C155.2 ; v1(30.94,3.4) 30.74,3.2 v1(30.37,3.2) ; 29.91,3.2 v1(30.37,3.2) ; v1(30.37,3.2) 30.85,2.73 v1(30.85,2.6)
  PWR w0.508: v1(30.37,3.2) 30.74,3.2 v1(30.94,3.4) ; v1(30.37,3.2) v1(29.25,3.2) 22.8,3.2 20.91,5.09 20.91,6.6 20.99,6.69 20.99,6.75 21.35,7.11 21.85,7.11 21.93,7.03 v1(22.4,7.03) v1(23.5,7.03) ; v1(30.37,3.2) 30.85,2.73 v1(30.85,2.6)
  Bottom Layer w0.508: v1(29.25,3.2) v1(30.37,3.2) 31,2.57 v1(33.4,2.57) v1(34.08,2.57) v1(34.85,2.57)
VCC_3V3: length 87.8
  Top Layer w0.203: 32.41,13.25 33.15,13.25
  Top Layer w0.254: C231.1 C230.1 v1(14.8,5.1) ; C231.1 C232.2 v1(14.8,6.5) ; C231.1 v1(14.8,5.8) ; 33.15,13.25 v1(33.38,13.48) ; U6.F5 v1(8.75,8.25) U6.E6 ; U6.J10 v1(7.25,6.75) U6.K9
  Top Layer w0.381: v1(7.25,6.75) v1(7.75,7.25) v1(8.3,7.8) v1(8.75,8.25) ; 34.41,13.9 v1(34.97,13.9) ; C133.1 v1(33.91,13.9) 33.8,13.9 v1(33.38,13.48)
  PWR w0.508: v1(7.25,6.75) v1(7.75,7.25) v1(8.3,7.8) 8.36,7.86 ; 30.5,28.4 34.71,24.19 34.71,19.19 34.97,18.93 34.97,14.55 ; 30.5,28.4 NOREF#104.117 ; 30.5,28.4 29.5,29.4 NOREF#93.116 ; 34.32,13.9 34.97,14.55 ; 34.32,13.9 34.39,13.9 ; 34.32,13.9 33.8,13.9 v1(33.38,13.48) ; 34.97,14.55 v1(34.97,13.9) ; v1(34.97,13.9) 34.39,13.9 ; v1(34.97,13.9) 34.97,13.32 ; 8.36,8.64 8.36,7.86 ; 8.36,8.64 v1(8.75,8.25) 8.36,7.86 ; 8.36,8.64 7.8,9.2 7.8,10.7 8.69,11.59 14.01,11.59 15.76,9.84 15.76,6.86 15.64,6.74 ; 15.64,5.36 15.3,5.7 ; 15.64,5.36 15.9,5.1 ; 15.64,5.36 15.64,6.74 ; 15.3,5.7 15.3,5.1 ; 15.3,5.7 15.3,6.4 15.4,6.5 ; 34.39,13.9 34.97,13.32 ; 15.3,5.1 v1(14.8,5.1) v1(14.8,5.8) v1(14.8,6.5) 15.4,6.5 ; 15.3,5.1 15.9,5.1 ; 15.4,6.5 15.64,6.74 ; 34.97,13.32 34.97,12.37 31.59,8.99 26.91,8.99 24.1,11.8 20.1,11.8 18.53,10.23 18.53,8.13 17.87,7.47 17.87,4.97 17.36,4.46 16.54,4.46 15.9,5.1
VCC_DDR: length 13
  Top Layer w0.127: R44.1 22.17,14.37 22.6,14.8 24.1,14.8 24.3,15 25.59,15
  Top Layer w0.254: 20.1,15.51 v1(20.1,16.07) ; 22.31,14.48 22.28,14.48 ; 19.13,16.17 19.13,16.95 ; v1(18.5,16.75) v1(18.5,16.07) 18.5,15.51 ; 19.6,15.5 v1(19.6,16.47) ; 19.6,15.5 C131.1 20.7,15.5 L6.2 ; 19.6,15.5 C132.2 ; 19.13,15.51 v1(19.13,16.07) ; 19.13,16.96 v1(19.13,17.52)
  Top Layer w0.381: L6.2 21.2,15.27 R44.1
  vias: v1(19.13,16.85)
VCCA1V8_IMAGE: length 14.9
  Top Layer w0.127: C125.1 v1(32,21.02) 31.75,20.77 31.75,20.45 30.05,18.75 30.05,18.41
  Top Layer w0.254: v1(32,22.97) 32.42,23.39 35.99,23.39 38.1,25.5 NOREF#95.3
  PWR w0.254: v1(32,22.97) v1(32,21.02)
VCCA1V8_PMU: length 13.7
  Top Layer w0.127: 30.4,18.41 30.4,18.78 v1(32.7,21.08) C124.1
  Bottom Layer w0.254: v1(32.7,21.08) 33.9,22.28 33.9,28.9 34.5,29.5 NOREF#87.121
VCCA_1V8: length 14.5
  Top Layer w0.127: 31.1,18.41 31.1,18.71 32.39,20 33.2,20 v1(34.1,20.9) C122.1
  Bottom Layer w0.254: NOREF#3.122 35.5,29.5 34.4,28.4 34.4,21.2 v1(34.1,20.9)
VCCIO_ACODEC: length 47
  Top Layer w0.127: C118.1 23.52,13.88 v1(23.69,13.88) 23.7,13.9 24.1,13.9 24.5,14.3 25.59,14.3
  Top Layer w0.254: NOREF#6.124 37.5,25.8 35.6,23.9 v1(32.2,23.9)
  PWR w0.254: v1(19.1,25.5) 23,25.5 27.6,20.9 29,20.9 29.37,20.53 29.37,19.48 29.75,19.1 30.6,19.1 31.2,19.7 31.2,22.9 v1(32.2,23.9)
  Bottom Layer w0.254: v1(19.1,25.5) 19.7,24.9 19.7,18.3 20.62,17.38 20.62,16.95 v1(23.69,13.88)
VCCIO_FLASH: length 104
  Top Layer w0.127: 9.9,14.77 C226.1
  Top Layer w0.152: 32.41,14.65 32.75,14.65 33,14.9
  Top Layer w0.203: U6.C6 9.75,7.75 9.75,6.15 9.4,5.8 v1(8.5,5.8) ; v1(4.25,10.25) U6.P3 U6.N4 ; U6.N4 U6.P5 ; U6.N4 U6.M4 ; v1(33.13,15.16) 33,15.03 33,14.9 ; 33.13,15.16 v3(33.59,15.62)
  Top Layer w0.254: 16.5,15.75 U15.22 16.5,16.11 v1(16.5,17.2) ; v1(38.4,11.53) 38.4,12.09 ; v1(15.73,14.35) 16.19,14.35 16.29,14.45 ; R85.2 C225.1 v1(16.8,7.2) ; R85.2 R84.1 v1(16.8,8.6) ; R85.2 v1(16.8,7.9) ; v1(20.1,17.2) 20.13,17.23 R49.1 ; 38.39,12.1 v1(37.83,12.1) ; C136.2 37.3,12.97 C162.2 ; C266.2 17.08,15.23 ; C227.1 v1(8.3,13.3) ; C227.1 C228.1 v1(7.5,13.3) ; C227.1 C226.1 v1(9.1,13.3) ; v1(15.79,13.74) 16.3,14.25 C267.2 15.88,14.03 15.8,14.03 15.4,13.63 ; 37.3,12.09 v1(37.3,11.53)
  Top Layer w0.381: 16.3,14.8 C267.2 17.08,15.23 17.01,15.23 16.5,15.75 16.5,15.29 16.3,15.1 16.3,14.8 ; 16.3,14.8 16.7,15.2 ; v1(15.79,13.74) 15.73,13.8 v1(15.73,14.35)
  PWR w0.254: v1(4.25,10.25) 4.77,9.73 6.95,9.73 7.23,9.45 7.23,8.73 6.73,8.23 6.73,6.27 7.2,5.8 v1(8.5,5.8) ; v1(20.1,17.2) 20.6,16.7 20.6,15.8 20.3,15.5 18.2,15.5 v1(16.5,17.2)
  PWR w0.381: v1(33.13,15.16) 31.8,13.83 31.8,12.7 31.2,12.1 25,12.1 24.4,12.7 18.2,12.7 ; 16.05,13.3 15.8,13.55 15.8,13.65 15.73,13.72 v1(15.73,14.35) ; 16.05,13.3 16.65,12.7 18.2,12.7 ; 16.05,13.3 v1(9.1,13.3) v1(8.3,13.3) v1(7.5,13.3) 6.5,13.3 4.12,10.92 4.12,10.38 v1(4.25,10.25) ; 18.2,12.7 17.6,12.1 17.6,9.33 16.87,8.6 v1(16.8,8.6) v1(16.8,7.9) v1(16.8,7.2) ; 33.13,15.16 v3(33.59,15.62)
  Bottom Layer w0.381: v3(33.59,15.62) 33.46,15.49 ; v3(33.59,15.62) 33.73,15.76 ; v3(33.59,15.62) 33.46,15.49 ; 33.46,15.49 v1(33.13,15.16) ; 34.32,16.36 35.8,17.83 35.8,19.6 37.7,21.5 NOREF#26.7 ; 34.32,16.36 33.73,15.76 ; 34.32,16.36 34.32,15.97 34.54,15.76 ; 34.54,15.76 35.8,14.5 35.8,12.3 36.57,11.53 v1(37.3,11.53) v1(38.4,11.53) ; 34.54,15.76 33.73,15.76
VCCIO_SD: length 28.3
  Top Layer w0.127: 25.59,13.95 24.55,13.95 v1(23.89,13.29) 23.3,12.7 C119.1
  PWR w0.254: NOREF#22.99 12.5,28.5 v1(15.3,25.7)
  Bottom Layer w0.254: v1(15.3,25.7) 16.8,25.7 19.16,23.34 19.16,18.71 17.99,17.55 17.99,15.9 18.6,15.3 20.88,15.3 22.9,13.29 v1(23.89,13.29)
VDD_CPU: length 13.7
  Top Layer w0.203: R54.2 C157.2 19.7,4.53 U3.A4
  Top Layer w0.254: v1(19.75,2.86) 19.73,2.88 19.73,3.66 19.6,3.78 ; 18.2,1.9 v1(18.6,1.5) ; C158.2 v1(18,1.53) ; C158.2 C160.2 18,5.77 L11.2 ; C158.2 v1(18.57,2.1) ; C159.2 v1(18.57,3.16) ; 18.2,2.6 v1(18.97,2.6)
  Bottom Layer w0.203: v1(19.75,2.86) 19.75,1.75 18.5,0.5 NOREF#51.46
VDD_GPU: length 19.2
  Top Layer w0.127: C126.2 R43.2 ; v3(30.06,19.75) 30.06,19.56 29.35,18.85 29.35,18.41
  Top Layer w0.254: 31.11,25.19 v1(31.51,24.79) ; v1(30.69,25.61) 31.09,25.21 ; 31.1,25.21 v1(31.5,25.61) ; 31.09,24.1 v1(30.69,24.5) ; C126.2 29.27,26.2 28.98,25.9 v1(28.98,25.82) ; C126.1 v1(31,26.2) ; v1(30.69,23.69) 31.09,24.09
  PWR w0.254: NOREF#69.112 25.5,28.7 28.38,25.82 v1(28.98,25.82) 29.28,25.82 29.8,25.3 29.8,20.01 v3(30.06,19.75)
VDD_LOGIC: length 19.2
  Top Layer w0.127: R41.1 C111.1 24.54,22.86 25.5,21.9 25.5,20.97 27.6,18.87 27.6,18.41
  Top Layer w0.254: 26.31,25.19 v1(26.71,24.79) ; 26.29,24.11 v1(25.89,24.51) ; 24.54,24.08 v1(24.54,24.64) ; 26.29,24.1 v1(25.89,23.7) ; 26.29,25.21 v1(25.89,25.61) ; v1(26.71,23.69) 26.31,24.09 ; v1(26.71,25.61) 26.31,25.21
  PWR w0.254: v1(24.54,24.64) 23.08,26.1 21.68,26.1 19.5,28.28 NOREF#41.106
VDD_NPU: length 31.7
  Top Layer w0.152: 32.41,16.4 37.93,16.4 R42.1
  Top Layer w0.254: v1(39.22,16) 38.75,16.47 R42.1 ; v1(38.81,18.61) 38.41,18.21 ; 38.39,18.19 v1(37.99,17.79) ; 37.31,18.21 v1(37.71,18.61) ; 37.3,18.21 v1(36.9,18.61) ; 38.41,18.19 v1(38.81,17.79) ; 37.29,18.19 v1(36.89,17.79)
  PWR w0.254: NOREF#14.32 32.53,0 33.26,0.73 37.4,0.73 39.2,2.53 39.2,15.95 39.22,15.97 v1(39.22,16)
VDDA0V9_IMAGE: length 28
  Top Layer w0.127: 25.59,16.05 24.95,16.05 23.7,17.3 23.7,18.4 v1(23.5,18.6) C108.1
  Bottom Layer w0.254: v1(23.5,18.6) 23.7,18.6 24.7,19.6 26.3,19.6 27.4,18.5 28.6,18.5 29.1,19 29.1,19.7 29.9,20.5 31.1,20.5 31.7,19.9 35.34,19.9 36.3,20.86 36.3,24.6 38.2,26.5 NOREF#12.2
VDDA0V9_PMU: length 21.7
  Top Layer w0.127: 25.59,17.1 25,17.1 24.38,17.72 24.38,19.92 v1(23.6,20.7) C110.1
  Bottom Layer w0.254: v1(23.6,20.7) 24.03,21.13 29.13,21.13 31.5,23.5 31.5,23.9 33.25,25.65 33.25,29.25 33.5,29.5 NOREF#82.120
VDDA_0V9: length 27
  Top Layer w0.127: C109.1 23.59,20 24.16,19.43 24.16,17.54 24.95,16.75 25.59,16.75
  Bottom Layer w0.254: NOREF#29.123 36.5,29.5 34.9,27.89 34.9,20.89 34.4,20.4 31.94,20.4 31.24,21.1 29.8,21.1 29.3,20.6 24.2,20.6 v1(23.6,20)
VIN_LDO: length 11.2
  Top Layer w0.381: 18.17,11.8 17.3,12.67 17.33,12.7 17.86,12.7 17.89,12.73 U15.23 ; 18.17,12.16 18.17,12.52 C269.2
  Top Layer w0.508: L16.1 18.17,12.16 17.63,12.7
  Top Layer w0.762: C269.2 18.45,11.28 L16.1
VIN_LDO_OUT: length 6.1
  Top Layer w0.381: U15.21 15.61,15.54 14.5,14.43 14.5,12.33 L16.2
$C98_1: length 4
  Top Layer w0.381: L2.1 28.28,2.25 U2.6 29.8,2.17 C98.1
$C98_2: length 1.2
  Top Layer w0.381: U2.1 32.2,2.17 C98.2
$C101_1: length 2.9
  Top Layer w0.381: U2.3 31.75,4.15 31.33,4.57 C101.1 R37.1 R40.2
$C103_2: length 3.3
  Top Layer w0.381: 29.48,4.15 U2.4 ; 29.48,4.15 28.82,4.15 ; 29.48,4.15 29.48,4.26 29.14,4.6 29.03,4.6 ; 28.82,4.15 28.8,4.13 ; 28.82,4.15 29.03,4.37 29.03,4.6 ; R122.2 C103.2 29.03,4.6
$C137_2: length 2.7
  Top Layer w0.152: 30.05,11.59 30.05,11.29 30.4,10.94 30.4,9.33 30.2,9.13
$C139_2: length 4.9
  Top Layer w0.127: 25.59,12.55 25.31,12.55 24.6,11.84 24.6,10.07 C139.2 24.03,9.19 L8.2
$C140_2: length 4.8
  Top Layer w0.127: X2.2 32.7,7.97 32.7,8.93 C140.2
  Top Layer w0.152: C140.2 32.3,9.33 32.3,9.91 31.45,10.76 31.45,11.59
$C141_1: length 3.8
  Top Layer w0.152: C141.1 25.95,8.72 25.95,10.65 26.55,11.25 26.55,11.59
$C141_2: length 2.7
  Top Layer w0.152: 26.9,11.59 26.9,11.24 26.4,10.74 26.4,9.13
$C143_1: length 5.9
  Top Layer w0.127: X2.1 33.8,7.5 33.27,8.03 C143.1
  Top Layer w0.152: 31.8,11.59 31.8,11 32.7,10.1 32.7,9.8 33.27,9.23 C143.1
$C144_2: length 2.7
  Top Layer w0.152: 27.1,9.13 26.85,9.39 26.85,10.78 27.25,11.19 27.25,11.59
$C145_2: length 2.7
  Top Layer w0.152: 25.5,9.13 25.5,10.89 26.2,11.59
$C146_2: length 2.5
  Top Layer w0.152: 30.9,9.13 30.9,10 30.75,10.15 30.75,11.59
$C147_2: length 2.7
  Top Layer w0.152: 28.8,9.13 28.97,9.31 28.97,9.78 29.35,10.16 29.35,11.59
$C150_1: length 3
  Top Layer w0.152: 28.1,9.13 28.1,9.67 C152.2 28.6,9.9 29,10.3 29,11.59
$C151_2: length 5.6
  Top Layer w0.152: 32.41,15.35 32.71,15.35 33.46,16.1 35.73,16.1 C151.2 R51.2 R48.1
$C233_2: length 6.5
  Top Layer w0.203: U6.C2 v1(9.75,10.25) ; C233.2 v1(14.87,9.3)
  Bottom Layer w0.203: v1(9.75,10.25) 13.92,10.25 v1(14.87,9.3)
$C261_1: length 1.7
  Top Layer w0.127: C261.1 2.9,25.33 RF1.1
$C261_2: length 1.9
  Top Layer w0.127: U15.2 4.26,25.61 C261.2
$L9_1: length 5.5
  Top Layer w0.127: 25.59,12.2 25.4,12.2 24.9,11.7 24.9,9.5 24.2,8.8 24.2,8 L9.1
$L10_1: length 4.4
  Top Layer w0.127: 25.59,12.9 25.3,12.9 24.2,11.8 24.2,10.8 23.8,10.4 22.8,10.4
$L11_1: length 4.5
  Top Layer w0.127: 19.9,7.5 U3.D3 ; 19.9,7.5 U3.D4 ; 19.9,7.5 U3.E3
  Top Layer w0.203: U3.E3 U3.E4 U3.D4 U3.D3 U3.E3
  Top Layer w0.381: 19.9,7.5 U3.E4 18.93,7.7 L11.1
$LED1_2: length 1.2
  Top Layer w0.254: LED1.2 21.96,21.6 R39.1
$R44_2: length 4.7
  Top Layer w0.127: 21.2,13.83 21.81,13.83 21.82,13.83 22.52,13.83 22.52,13.83 22.57,13.83 R44.2 24.1,14.3 24.45,14.65 25.59,14.65
$R53_1: length 1.1
  Top Layer w0.203: U3.A2 20.5,5.7 20.87,5.33 21,5.33
$R107_1: length 1.4
  Top Layer w0.127: U15.29 19.26,22.89 R107.1
BT_REG_ON_H: length 38.5
  Top Layer w0.127: U15.34 v1(16.5,25)
  Bottom Layer w0.127: v1(16.5,25) 17.3,24.2 17.3,15.3 25.01,7.58 25.01,4.78 28.7,1.1 34,1.1 34.5,0.6 NOREF#56.30
BT_WAKE_HOST_H: length 37.3
  Top Layer w0.127: U15.7 v1(7.2,21.11)
  Bottom Layer w0.127: v1(7.2,21.11) 6.99,21.11 6.6,21.5 6.6,22.3 7,22.7 10.6,22.7 15.1,18.2 15.1,15.6 17.07,13.63 17.07,12.43 20.73,8.77 21.51,8.77 21.83,8.44 21.83,7.97 22.2,7.6 22.7,7.6 23,7.3 23,5.29 27.5,0.79 NOREF#15.37
EMMC_CLKOUT/FLASH_DQS: length 15
  Top Layer w0.127: v1(10.2,3) 4.9,3 4.2,3.7 4.2,6.7 U6.M6
  Bottom Layer w0.127: v1(10.2,3) 11.5,1.7 NOREF#61.53
EMMC_CMD: length 24.2
  Top Layer w0.127: R85.1 v1(14.87,7.9) ; v1(6.25,6.25) 6.25,8.25 U6.M5 v1(6.25,8.75)
  Bottom Layer w0.127: v1(6.25,8.75) 6.25,9.75 7.7,11.2 13.7,11.2 15.5,9.4 15.5,8.53 v1(14.87,7.9) ; NOREF#43.56 8.5,4 v1(6.25,6.25)
EMMC_D0/FLASH_D0: length 16.5
  Top Layer w0.127: NOREF#45.49 15.5,0.5 13.6,2.4 13.6,4.08 13.51,4.17 13.49,4.17 13.4,4.26 13.4,4.59 13.49,4.68 13.71,4.68 13.8,4.77 13.8,5.1 13.71,5.19 13.49,5.19 13.4,5.28 13.4,5.61 13.49,5.7 13.71,5.7 13.8,5.79 13.8,6.12 13.71,6.21 13.49,6.21 13.4,6.3 13.4,6.62 13.49,6.71 13.71,6.71 13.8,6.8 13.8,7.13 13.71,7.22 13.49,7.22 13.4,7.31 13.4,7.64 13.49,7.73 13.71,7.73 13.8,7.82 13.8,8.15 13.71,8.24 13.69,8.24 13.6,8.33 v1(13.6,8.9) 12.75,9.75 U6.A3 ; 15.37,8.6 v1(14.87,8.6)
  Bottom Layer w0.127: v1(13.6,8.9) 13.9,8.6 v1(14.87,8.6)
EMMC_D1/FLASH_D1: length 11.9
  Top Layer w0.127: U6.A4 12.25,9.25 12.9,8.6 12.9,3.4 NOREF#7.55
EMMC_D2/FLASH_D2: length 14.8
  Top Layer w0.127: U6.A5 v1(11.75,8.75)
  Bottom Layer w0.127: v1(11.75,8.75) 11.75,7.84 11.84,7.75 12.31,7.75 12.4,7.66 12.4,7.33 12.31,7.24 11.84,7.24 11.75,7.15 11.75,6.83 11.84,6.73 12.31,6.73 12.4,6.65 12.4,6.32 12.31,6.23 11.84,6.23 11.75,6.14 11.75,5.81 11.84,5.72 12.31,5.72 12.4,5.63 12.4,5.3 12.31,5.21 11.84,5.21 11.75,5.12 11.75,4.75 14.5,2 14.5,1.48 14.59,1.39 15.11,1.39 15.2,1.3 15.2,0.97 15.11,0.88 14.59,0.88 14.5,0.79 NOREF#83.50
EMMC_D3/FLASH_D3: length 13.2
  Top Layer w0.127: U6.B2 v1(10.75,10.75)
  Bottom Layer w0.127: v1(10.75,10.75) 9.65,10.75 9.05,10.15 9.05,8.54 9.18,8.41 9.18,2.12 10.5,0.8 NOREF#24.54
EMMC_D4/FLASH_D4: length 17.9
  Top Layer w0.127: NOREF#123.47 16.6,0.9 15.9,0.9 14.2,2.6 14.2,3 14.29,3.09 14.91,3.09 15,3.18 15,3.51 14.91,3.6 14.29,3.6 14.2,3.69 14.2,4.02 14.29,4.11 14.91,4.11 15,4.2 15,4.53 14.91,4.62 14.29,4.62 14.2,4.71 14.2,9.3 13.2,10.3 11.3,10.3 U6.B3
EMMC_D5/FLASH_D5: length 14.6
  Top Layer w0.127: U6.B4 v1(10.25,9.75)
  Bottom Layer w0.127: v1(10.25,9.75) 9.55,9.75 9.33,9.53 9.33,8.87 10.2,8 10.2,7.65 10.11,7.56 9.84,7.56 9.75,7.47 9.75,7.14 9.84,7.05 10.11,7.05 10.2,6.96 10.2,6.64 10.11,6.55 9.84,6.55 9.75,6.46 9.75,6.13 9.84,6.04 10.11,6.04 10.2,5.95 10.2,5.62 10.11,5.53 9.84,5.53 9.75,5.44 9.75,5.11 9.84,5.02 10.11,5.02 10.2,4.93 10.2,4.4 12.5,2.1 NOREF#23.52
EMMC_D6/FLASH_D6: length 14.3
  Top Layer w0.127: v1(10.25,8.75) U6.B5
  Bottom Layer w0.127: NOREF#122.51 13.5,1.8 13.01,2.29 13.01,2.41 13.19,2.59 13.19,2.71 12.95,2.95 12.83,2.95 12.65,2.77 12.53,2.77 12.3,3 12.3,3.13 12.47,3.3 12.47,3.43 12.24,3.66 12.11,3.66 11.94,3.49 11.81,3.49 11.58,3.72 11.58,3.85 11.75,4.02 11.75,4.15 11.52,4.38 11.39,4.38 11.22,4.21 11.09,4.21 10.7,4.6 10.7,5.54 10.79,5.63 11.16,5.63 11.25,5.72 11.25,6.05 11.16,6.14 10.79,6.14 10.7,6.23 10.7,6.56 10.79,6.65 11.16,6.65 11.25,6.74 11.25,7.06 11.16,7.15 10.79,7.15 10.7,7.24 10.7,8.3 v1(10.25,8.75)
EMMC_D7/FLASH_D7: length 18.4
  Top Layer w0.127: U6.B6 v1(11.25,7.75)
  Bottom Layer w0.127: NOREF#78.48 16.5,0.8 12.8,4.5 12.8,4.95 12.89,5.04 13.31,5.04 13.4,5.13 13.4,5.46 13.31,5.55 12.89,5.55 12.8,5.64 12.8,5.97 12.89,6.05 13.31,6.05 13.4,6.14 13.4,6.47 13.31,6.56 12.89,6.56 12.8,6.65 12.8,6.98 12.89,7.07 13.31,7.07 13.4,7.16 13.4,7.49 13.31,7.58 12.89,7.58 12.8,7.67 12.8,8 12.89,8.09 13.31,8.09 13.4,8.18 13.4,8.5 13.31,8.59 12.89,8.59 12.8,8.68 12.8,9 12.3,9.5 11.7,9.5 11.25,9.05 v1(11.25,7.75)
EMMC_DATA_STROBE: length 10.7
  Top Layer w0.127: U6.H5 v1(7.75,8.25)
  Bottom Layer w0.127: NOREF#42.57 7.5,3.5 5.84,5.17 5.84,7.14 6.95,8.25 v1(7.75,8.25)
